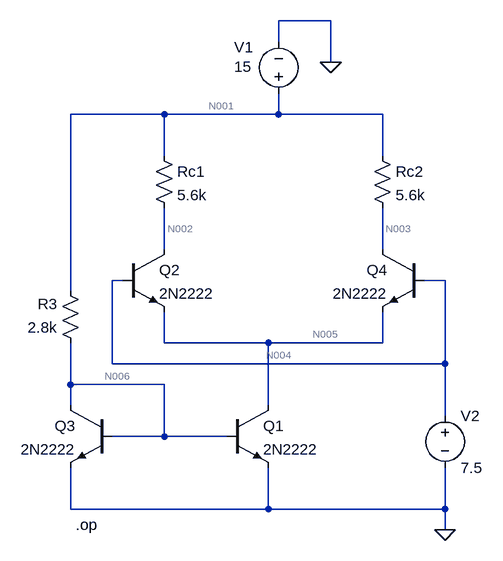
[diagram p0: schematic task.asc]
task.asc, the LTspice schematic file:
Version 4
SHEET 1 880 1000
WIRE 208 -128 128 -128
WIRE 128 -96 128 -128
WIRE 208 -64 208 -128
WIRE -48 16 -192 16
WIRE 128 16 128 -16
WIRE 128 16 -48 16
WIRE 288 16 128 16
WIRE -48 80 -48 16
WIRE 288 80 288 16
WIRE -48 224 -48 160
WIRE 288 224 288 160
WIRE -112 272 -128 272
WIRE 384 272 352 272
WIRE -192 288 -192 16
WIRE -48 368 -48 320
WIRE 112 368 -48 368
WIRE 288 368 288 320
WIRE 288 368 112 368
WIRE -128 400 -128 272
WIRE 384 400 384 272
WIRE 384 400 -128 400
WIRE -192 432 -192 368
WIRE -48 432 -192 432
WIRE -192 464 -192 432
WIRE 112 464 112 368
WIRE 384 480 384 400
WIRE -48 512 -48 432
WIRE -48 512 -128 512
WIRE 48 512 -48 512
WIRE -192 624 -192 560
WIRE 112 624 112 560
WIRE 112 624 -192 624
WIRE 384 624 384 560
WIRE 384 624 112 624
WIRE 384 656 384 624
FLAG 384 656 0
FLAG 208 -64 0
SYMBOL res -64 64 R0
SYMATTR InstName Rc1
SYMATTR Value 5.6k
SYMBOL res 272 64 R0
SYMATTR InstName Rc2
SYMATTR Value 5.6k
SYMBOL res -176 384 R180
WINDOW 0 36 76 Left 2
WINDOW 3 36 40 Left 2
SYMATTR InstName R3
SYMATTR Value 2.8k
SYMBOL voltage 128 0 R180
WINDOW 0 39 87 Left 2
WINDOW 3 41 57 Left 2
WINDOW 123 0 0 Left 0
WINDOW 39 0 0 Left 0
SYMATTR InstName V1
SYMATTR Value 15
SYMBOL npn 48 464 R0
SYMATTR InstName Q1
SYMATTR Value 2N2222
SYMBOL npn -112 224 R0
SYMATTR InstName Q2
SYMATTR Value 2N2222
SYMBOL npn -128 464 M0
SYMATTR InstName Q3
SYMATTR Value 2N2222
SYMBOL npn 352 224 M0
SYMATTR InstName Q4
SYMATTR Value 2N2222
SYMBOL voltage 384 464 R0
WINDOW 123 0 0 Left 0
WINDOW 39 0 0 Left 0
SYMATTR InstName V2
SYMATTR Value 7.5
TEXT -184 648 Left 2 !.op

The netlist it stands for:
* task.asc
Rc1 N001 N002 5.6k
Rc2 N001 N003 5.6k
R3 N006 N001 2.8k
V1 N001 0 15
Q1 N005 N006 0 0 2N2222
Q2 N002 N004 N005 0 2N2222
Q3 N006 N006 0 0 2N2222
Q4 N003 N004 N005 0 2N2222
V2 N004 0 7.5
.model NPN NPN
.model PNP PNP
.lib standard.bjt
.op
.backanno
.end

* Results of the author's LTspice run, read from the files saved beside the schematic
* Operating Point:
*   V(n001) = 15 V
*   V(n002) = 6.8 V
*   V(n003) = 6.8 V
*   V(n006) = 698.7 mV
*   V(n005) = 6.785 V
*   V(n004) = 7.5 V
*   Ic(Q4) = 1.464 mA
*   Ib(Q4) = 1.212 mA
*   Ie(Q4) = -2.676 mA
*   Ic(Q3) = 5.056 mA
*   Ib(Q3) = 25.71 µA
*   Ie(Q3) = -5.082 mA
*   Ic(Q2) = 1.464 mA
*   Ib(Q2) = 1.212 mA
*   Ie(Q2) = -2.676 mA
*   Ic(Q1) = 5.352 mA
*   Ib(Q1) = 25.65 µA
*   Ie(Q1) = -5.378 mA
*   I(R3) = -5.108 mA
*   I(Rc2) = 1.464 mA
*   I(Rc1) = 1.464 mA
*   I(V2) = -2.424 mA
*   I(V1) = -8.036 mA